# EAGLE board radiva5 (EAGLE 7.7.0)
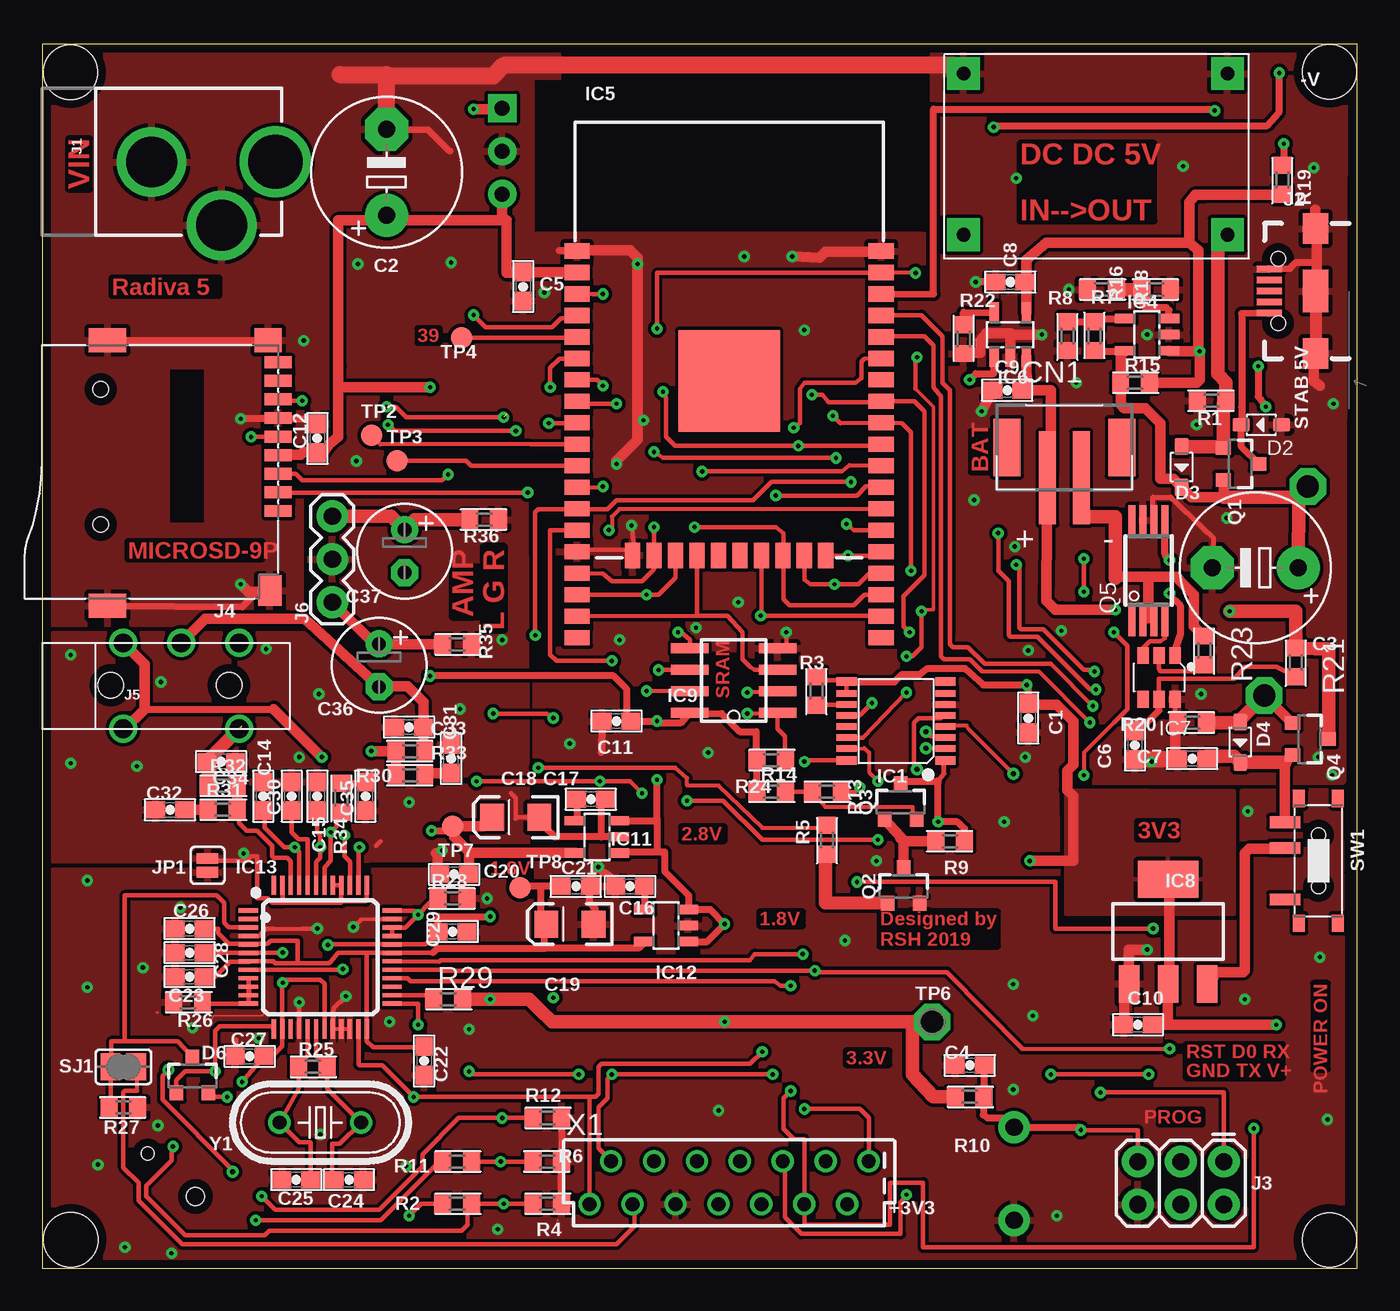
[diagram p2: board, top side]
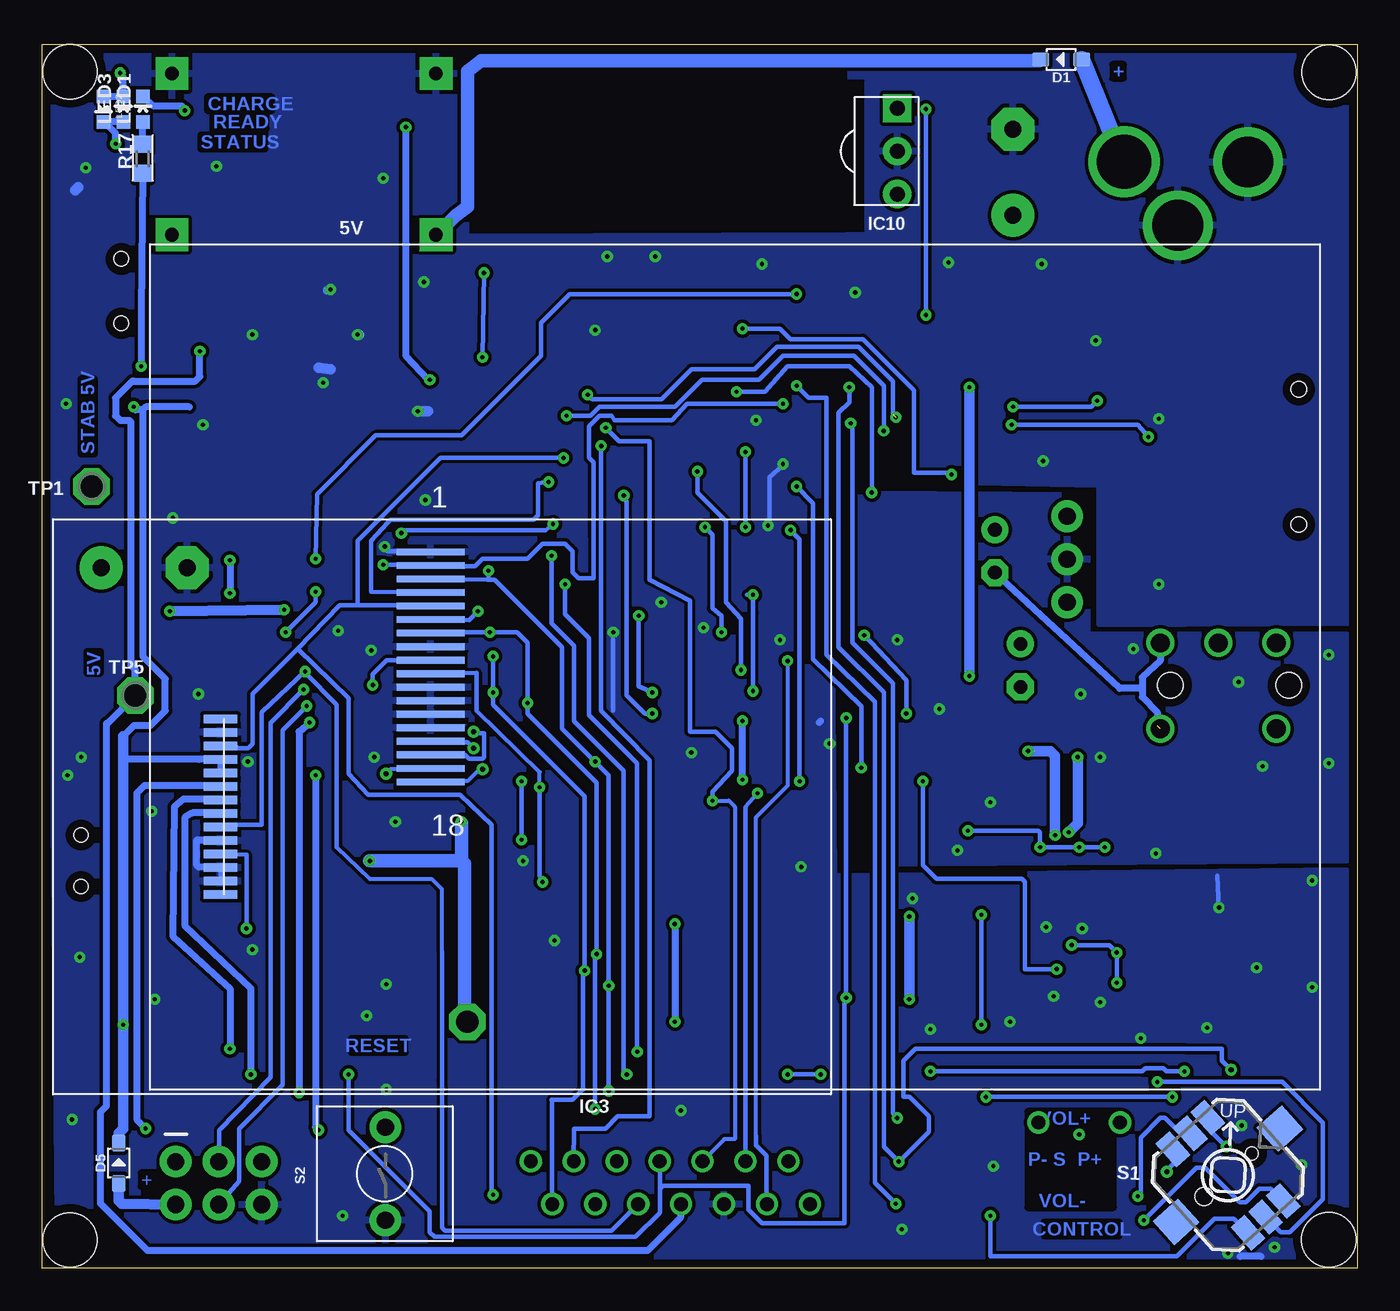
[diagram p3: board, bottom side, seen from below]

Size 77.78 x 72.38 mm. Coordinates in mm from the lower left corner, seen from the top.
Outline: 0,0 77.78,0 77.78,72.38 0,72.38 0,0
Copper layers (1*16): Top 0.035mm / dielectric 1.5mm / Bottom 0.035mm
Design rules "default *": minimum track width 5mil, minimum drill 0.3mm, track to track 8mil, track to pad 8mil, pad to pad 8mil, via to via 8mil, smd to smd 8mil, copper to edge 0.5mm, drill to drill 8mil, minimum pad ring 10mil, minimum via ring 8mil, stop-mask expansion 4mil, vias tented up to drill 0.8mm, thermal gap 10mil
Net classes: 0 default: clearance 0.205 mm; 1 power: width 0.406 mm
Holes 3.2 mm at 1.68,1.69 76.14,1.68 1.66,70.73 76.14,70.75

## Footprints (pad centres in the part's own frame; a part is rotated, then mirrored left to right if it is on the bottom)
0603-CAP = smd 1.1 x 1: 1 -0.85,0; 2 0.85,0
E5-8,5 = drill 1.016 pad 2.54: + -2.54,0 | drill 1.016 pad 2.54 octagon: - 2.54,0
EIA3216 = smd 1.4 x 1.6: A 1.4,0; C -1.4,0
E2,5-6 = drill 0.813 pad 1.6: + -1.27,0 | drill 0.813 pad 1.6 octagon: - 1.27,0
JST-PH-2-SMT = smd 1 x 5.5: 1 -1,-1.8; 2 1,-1.8 | smd 1.6 x 3.4: NC1 -3.4,0; NC2 3.4,0
SOD-323 = smd 1 x 0.8: + -1.2,0; - 1.2,0
SOT23-3 = smd 0.8 x 0.9: 1 -0.95,-1; 2 0.95,-1; 3 0,1.1
TSSOP16-0.65-5X4.4MM = smd 0.5 x 1.2: 1 -2.325,-2.925; 8 2.325,-2.925; 9 2.325,2.925; 16 -2.325,2.925 | smd 0.4 x 1.2: 2 -1.625,-2.925; 3 -0.975,-2.925; 4 -0.325,-2.925; 5 0.325,-2.925; 6 0.975,-2.925; 7 1.625,-2.925; 10 1.625,2.925; 11 0.975,2.925; 12 0.325,2.925; 13 -0.325,2.925; 14 -0.975,2.925; 15 -1.625,2.925
DC-DC_MP2307DN = drill 0.8 pad 1.93 square: VIN+ -7.747,-4.318; VIN- -7.747,5.207; VOUT+ 7.874,-4.318; VOUT- 7.874,5.207
TFT-DISPLAY-2.8 = smd 4 x 0.4: P$1 -18,6.8; P$2 -18,6; P$3 -18,5.2; P$4 -18,4.4; P$5 -18,3.6; P$6 -18,2.8; P$7 -18,2; P$8 -18,1.2; P$9 -18,0.4; P$10 -18,-0.4; P$11 -18,-1.2; P$12 -18,-2; P$13 -18,-2.8; P$14 -18,-3.6; P$15 -18,-4.4; P$16 -18,-5.2; P$17 -18,-6; P$18 -18,-6.8
SOT23-5 = smd 0.55 x 1.2: 1 -0.95,-1.3; 2 0,-1.3; 3 0.95,-1.3; 4 0.95,1.3; 5 -0.95,1.3
ESP-WROOM-WROOVER-32 = smd 0.9 x 1.5: 1 7.7,9; 2 6.43,9; 3 5.16,9; 4 3.89,9; 5 2.62,9; 6 1.35,9; 7 0.08,9; 8 -1.19,9; 9 -2.46,9; 10 -3.73,9; 11 -5,9; 12 -6.27,9; 13 -7.54,9; 14 -8.81,9; 25 -8.81,-9; 26 -7.54,-9; 27 -6.27,-9; 28 -5,-9; 29 -3.73,-9; 30 -2.46,-9; 31 -1.19,-9; 32 0.08,-9; 33 1.35,-9; 34 2.62,-9; 35 3.89,-9; 36 5.16,-9; 37 6.43,-9; 38 7.7,-9; 39 -10.08,9; 40 -11.35,9; 41 -12.62,9; 42 -13.89,9; 43 -15.16,9; 44 -15.16,-9; 45 -13.89,-9; 46 -12.62,-9; 47 -11.35,-9; 48 -10.08,-9 | smd 1.5 x 0.9: 15 -10.3,5.715; 16 -10.3,4.445; 17 -10.3,3.175; 18 -10.3,1.905; 19 -10.3,0.635; 20 -10.3,-0.635; 21 -10.3,-1.905; 22 -10.3,-3.175; 23 -10.3,-4.445; 24 -10.3,-5.715 | smd 6 x 6: GND 0,0
SOT-23-6 = smd 0.69 x 1: 1 -0.95,-1.3; 2 0,-1.3; 3 0.95,-1.3; 4 0.95,1.3; 5 0,1.3; 6 -0.95,1.3
SOT223 = smd 1.219 x 2.235: 1 -2.311,-3.099; 2 0,-3.099; 3 2.311,-3.099 | smd 3.6 x 2.2: 4 0,3.099
SO-08 = smd 0.6 x 2.2: 1 -1.905,-2.6; 2 -0.635,-2.6; 3 0.635,-2.6; 4 1.905,-2.6; 5 1.905,2.6; 6 0.635,2.6; 7 -0.635,2.6; 8 -1.905,2.6
IR = drill 0.9 pad 1.676 square: P$1 -2.54,0 | drill 0.9 pad 1.676: P$2 0,0; P$3 2.54,0
LQFP-48 = smd 0.254 x 1.143: 1 -2.75,-4.25; 2 -2.25,-4.25; 3 -1.75,-4.25; 4 -1.25,-4.25; 5 -0.75,-4.25; 6 -0.25,-4.25; 7 0.25,-4.25; 8 0.75,-4.25; 9 1.25,-4.25; 10 1.75,-4.25; 11 2.25,-4.25; 12 2.75,-4.25; 25 2.75,4.25; 26 2.25,4.25; 27 1.75,4.25; 28 1.25,4.25; 29 0.75,4.25; 30 0.25,4.25; 31 -0.25,4.25; 32 -0.75,4.25; 33 -1.25,4.25; 34 -1.75,4.25; 35 -2.25,4.25; 36 -2.75,4.25 | smd 1.143 x 0.254: 13 4.25,-2.75; 14 4.25,-2.25; 15 4.25,-1.75; 16 4.25,-1.25; 17 4.25,-0.75; 18 4.25,-0.25; 19 4.25,0.25; 20 4.25,0.75; 21 4.25,1.25; 22 4.25,1.75; 23 4.25,2.25; 24 4.25,2.75; 37 -4.25,2.75; 38 -4.25,2.25; 39 -4.25,1.75; 40 -4.25,1.25; 41 -4.25,0.75; 42 -4.25,0.25; 43 -4.25,-0.25; 44 -4.25,-0.75; 45 -4.25,-1.25; 46 -4.25,-1.75; 47 -4.25,-2.25; 48 -4.25,-2.75
POWER_JACK_PTH_LOCK = drill 2.997 pad 4.115: GND 0.025,6.557; GNDBREAK 3.762,10.7 | drill 3.2 pad 4.115: PWR 0,13.878
USB-B-MICRO-SMD = smd 1.45 x 0.4: D+ 2.725,0; D- 2.725,0.65; GND 2.725,-1.3; ID 2.725,-0.65; VBUS 2.725,1.3 | smd 1.5 x 1.8: SHIELD1 0,3.685; SHIELD2 0,-3.685 | smd 1.5 x 2.5: SHIELD3 0,0 | hole 0.85: 2.2,1.9; 2.2,-1.9
2X3 = drill 1.016 pad 1.88: 1 0,0; 2 0,2.54; 3 2.54,0; 4 2.54,2.54; 5 5.08,0; 6 5.08,2.54
MICRO-SD9+4P-SMD-16.1X14.5X1.85MM = smd 1.6 x 0.7: 1 0,2.25; 2 0,1.15; 3 0,0.05; 4 0,-1.05; 5 0,-2.15; 6 0,-3.25; 7 0,-4.35; 8 0,-5.45; 9 0,-6.55 | smd 1.6 x 1.4: G1 0.6,-7.85 | smd 2.2 x 1.4: G2 10.1,-7.85; G3 10.1,7.85 | smd 1.4 x 1.8: G4 0.5,6.95 | hole 0.9: 10.5,-4.95; 10.5,3.05
AUDIO-JACK = drill 1.1: P$1 0,0; P$2 0,-3.429; P$3 0,-6.858; P$4 5.08,-6.858; P$5 5.08,0 | hole 1.5: 2.5,-0.6; 2.5,-7.6
1X03 = drill 1.016 pad 1.88: 1 0,0; 2 2.54,0; 3 5.08,0
SJ_2S = smd 0.635 x 1.27: 1 -0.412,0; 2 0.412,0
JD-T1800 = smd 0.5 x 2: 1 5.2,-13.1; 2 4.4,-13.1; 3 3.6,-13.1; 4 2.8,-13.1; 5 2,-13.1; 6 1.2,-13.1; 7 0.4,-13.1; 8 -0.4,-13.1; 9 -1.2,-13.1; 10 -2,-13.1; 11 -2.8,-13.1; 12 -3.6,-13.1; 13 -4.4,-13.1; 14 -5.2,-13.1
LED-0603 = smd 0.8 x 0.8: A 0,-0.75; C 0,0.75
TSSOP-8 = smd 0.42 x 1.78: 1 -0.975,-2.975; 2 -0.325,-2.975; 3 0.325,-2.975; 4 0.975,-2.975; 5 0.975,2.975; 6 0.325,2.975; 7 -0.325,2.975; 8 -0.975,2.975
R0603 = smd 1 x 1.1: 1 -0.85,0; 2 0.85,0
JOYSTICK_MINI = smd 1.85 x 1.1: A -3.325,1.4; B 3.325,1.4; C -3.325,-1.4; CTR -3.325,0; D 3.325,-1.4; GND 3.325,0 | smd 1.9 x 2: NC 0,4.13; NC@0 0,-4.13 | hole 0.75: 0,1.9 | hole 1.05: 0,-1.9
TACTILE_SWITCH_PTH_8.0MM = drill 1.016 pad 1.88: 1 -2.851,-0.039; 2 2.651,-0.039
SJ = smd 1.168 x 1.6: 1 -0.762,0; 2 0.762,0
SW7-SMD-L6.7X2.7X3.2MM = smd 1.8 x 0.7: A 1.978,2.286; B 1.978,-2.286; COM 1.978,-0.762 | smd 0.7 x 1.016: SS1 -1.15,-3.683; SS2 1.15,-3.683; SS3 1.15,3.683; SS4 -1.15,3.683 | hole 0.813: 0,-1.524; 0,1.524
P1-13 = drill 1.321 pad 2.159 octagon: TP 0,0
B1,27 = smd 1.27 x 1.27: TP 0,0
FSIDE-14 = drill 0.813: 1 -8.255,-1.27; 2 -6.985,1.27; 3 -5.715,-1.27; 4 -4.445,1.27; 5 -3.175,-1.27; 6 -1.905,1.27; 7 -0.635,-1.27; 8 0.635,1.27; 9 1.905,-1.27; 10 3.175,1.27; 11 4.445,-1.27; 12 5.715,1.27; 13 6.985,-1.27; 14 8.255,1.27
HC49U = drill 0.813: 1 -2.413,0; 2 2.413,0

## Placement (x,y rotation side)
C1  106C  [0603-CAP]  58.32,32.54 90 top
C2  108C  [E5-8,5]  20.36,64.81 90 top
C3  687C  [E5-8,5]  71.74,41.43 180 top
C4  104C  [0603-CAP]  54.85,12 0 top
C5  106C  [0603-CAP]  28.45,58.05 270 top
C6  106C  [0603-CAP]  64.63,30.94 90 top
C7  106C  [0603-CAP]  68.01,30.14 0 top
C8  106C  [0603-CAP]  57.25,58.32 180 top
C9  106C  [0603-CAP]  57.07,51.92 0 top
C10  106C  [0603-CAP]  64.81,14.4 0 top
C11  106C  [0603-CAP]  33.96,32.36 180 top
C12  106C  [0603-CAP]  16.27,49.07 90 top
C14  104C  [0603-CAP]  13.07,27.91 90 top
C15  104C  [0603-CAP]  16.27,27.91 90 top
C16  104C  [0603-CAP]  34.76,22.58 180 top
C17  104C  [0603-CAP]  32.45,27.74 0 top
C18  106C  [EIA3216]  28,26.67 180 top
C19  106C  [EIA3216]  31.2,20.36 180 top
C20  104C  [0603-CAP]  24.36,23.29 180 top
C21  104C  [0603-CAP]  31.56,22.58 0 top
C22  104C  [0603-CAP]  22.58,12.27 270 top
C23  104C  [0603-CAP]  8.71,17.25 180 top
C24  18pF  [0603-CAP]  18.14,5.25 180 top
C25  18pF  [0603-CAP]  15.02,5.25 0 top
C26  104C  [0603-CAP]  8.71,20.09 180 top
C27  104C  [0603-CAP]  12.27,12.53 180 top
C28  104C  [0603-CAP]  8.71,18.67 180 top
C29  103C  [0603-CAP]  24.27,19.91 0 top
C30  105C  [0603-CAP]  14.76,27.91 270 top
C31  103C  [0603-CAP]  24.18,30.14 90 top
C32  103C  [0603-CAP]  7.56,27.11 180 top
C33  033C  [0603-CAP]  21.69,32 180 top
C34  033C  [0603-CAP]  10.58,29.96 0 top
C35  473C  [0603-CAP]  19.11,27.91 270 top
C36  227C  [E2,5-6]  19.91,35.65 270 top
C37  227C  [E2,5-6]  21.42,42.41 270 top
CN1  BAT  [JST-PH-2-SMT]  60.45,48.54 0 top
D1  S4  [SOD-323]  17.51,71.48 180 bottom
D2  S4  [SOD-323]  72.1,49.87 180 top
D3  S4  [SOD-323]  67.39,47.38 270 top
D4  S4  [SOD-323]  70.85,31.11 270 top
D5  S4  [SOD-323]  73.25,6.22 90 bottom
D6  BAV60  [SOT23-3]  8.89,11.38 0 top
IC1  TOUCH  [TSSOP16-0.65-5X4.4MM]  50.5,32.36 90 top
IC2  DC-DC 5V  [DC-DC_MP2307DN]  62.23,65.43 0 top
IC3  TFT-DISPLAY-2.8  [TFT-DISPLAY-2.8]  36.8,35.56 0 bottom
IC4  SY6280  [SOT23-5]  65.34,55.21 90 top
IC5  ESP  [ESP-WROOM-WROOVER-32]  40.63,52.45 90 top
IC6  LT4  [SOT23-5]  57.25,55.21 0 top
IC7  DW01  [SOT-23-6]  66.05,34.94 180 top
IC8  LM1117-3.3  [SOT223]  66.59,19.91 0 top
IC9  SRAM  [SO-08]  40.89,34.76 90 top
IC10  VS1838  [IR]  27.2,66.05 270 bottom
IC11  2.8V  [SOT23-5]  32.8,25.51 90 top
IC12  1.8V  [SOT23-5]  36.89,20.27 90 top
IC13  VS1053B  [LQFP-48]  16.45,18.4 270 top
J1  VIN  [POWER_JACK_PTH_LOCK]  -0.09,65.43 270 top
J2  [USB-B-MICRO-SMD]  75.3,57.78 180 top
J3  PROG  [2X3]  69.88,6.31 180 top
J4  MICROSD-9P  [MICRO-SD9+4P-SMD-16.1X14.5X1.85MM]  13.96,47.03 180 top
J5  AUDIO-JACK  [AUDIO-JACK]  11.65,36.98 270 top
J6  AMP  [1X03]  17.16,39.38 90 top
JP1  A-G  [SJ_2S]  9.78,23.83 90 top
LCD1  TFT-DISPLAY-1.8  [JD-T1800]  54.14,27.29 270 bottom
LED1  STATUS  [LED-0603]  71.83,68.54 0 bottom
LED2  READY  [LED-0603]  74.14,68.54 180 bottom
LED3  CHARGE  [LED-0603]  72.99,68.54 0 bottom
Q1  S1  [SOT23-3]  70.85,47.56 270 top
Q2  Q2  [SOT23-3]  50.94,22.58 0 top
Q3  Q3  [SOT23-3]  50.76,27.56 0 top
Q4  S1  [SOT23-3]  74.94,31.29 270 top
Q5  8205A  [TSSOP-8]  65.43,41.25 0 top
R1  104R  [R0603]  69.16,51.3 180 top
R2  103R  [R0603]  24.54,3.82 0 top
R3  103R  [R0603]  45.78,34.14 270 top
R4  103R  [R0603]  29.87,3.82 0 top
R5  102R  [R0603]  46.41,25.34 270 top
R6  103R  [R0603]  29.87,6.31 180 top
R7  104R  [R0603]  62.23,55.12 90 top
R8  104R  [R0603]  60.63,55.12 270 top
R9  103R  [R0603]  53.7,25.25 180 top
R10  104R  [R0603]  54.85,10.13 0 top
R11  103R  [R0603]  24.54,6.31 0 top
R12  103R  [R0603]  29.87,8.89 0 top
R13  100R  [R0603]  46.41,28.18 0 top
R14  000  [R0603]  43.12,28.18 0 top
R15  000  [R0603]  64.63,52.36 0 top
R16  682R  [R0603]  65.87,57.87 180 top
R17  102R  [R0603]  71.83,65.61 90 bottom
R18  682R  [R0603]  62.67,57.87 0 top
R19  102R  [R0603]  73.34,64.36 270 top
R20  103R  [R0603]  68.01,32.27 180 top
R21  101R  [R0603]  74.14,35.83 270 top
R22  112R  [R0603]  54.5,54.94 90 top
R23  102R  [R0603]  68.72,36.54 270 top
R24  103R  [R0603]  43.12,30.05 0 top
R25  105R  [R0603]  16,11.91 0 top
R26  104R  [R0603]  8.62,15.74 0 top
R27  103R  [R0603]  4.8,9.51 180 top
R28  104R  [R0603]  24.27,21.87 180 top
R29  104R  [R0603]  24,15.91 0 top
R30  200R  [R0603]  21.78,29.16 180 top
R31  200R  [R0603]  10.67,27.11 0 top
R32  471R  [R0603]  10.67,28.54 0 top
R33  471R  [R0603]  21.78,30.58 180 top
R34  100R  [R0603]  17.69,27.83 270 top
R35  473R  [R0603]  24.54,36.89 0 top
R36  473R  [R0603]  26.14,44.27 180 top
S1  CONTROL  [JOYSTICK_MINI]  7.65,5.51 312 bottom
S2  RESET  [TACTILE_SWITCH_PTH_8.0MM]  57.52,5.69 90 bottom
SJ1  XRST_ON  [SJ]  4.8,11.91 180 top
SW1  POWER ON  [SW7-SMD-L6.7X2.7X3.2MM]  75.48,24.09 180 top
TP1  STAB 5V  [P1-13]  74.85,46.23 270 bottom
TP2  25  [B1,27]  19.47,49.25 0 top
TP3  26  [B1,27]  20.98,47.74 0 top
TP4  39  [B1,27]  24.8,55.03 180 top
TP5  5V  [P1-13]  72.28,33.87 0 bottom
TP6  3.3V  [P1-13]  52.63,14.58 0 top
TP7  2.8V  [B1,27]  24.27,26.14 0 top
TP8  1.8V  [B1,27]  28.27,22.49 0 top
X1  [FSIDE-14]  40.63,5.07 0 top
Y1  12.288MHz  [HC49U]  16.45,8.62 0 top

## Tracks (layer width: path | path; a pad name or v marks a point on that pad's centre or on a via)
0  (via drill 0.25 pad 0.61)
  Top 0.254: v47.56,44.01 48.01,43.65 IC5.25 | v62.32,34.23 61.96,34.23 58.85,37.34 57.25,37.34 57.16,37.43 57.16,40.63 56.54,41.25 56.54,43.38 v56.54,43.47
  Bottom 0.254: J3.3 67.3,8.18 64.28,11.29 64.28,32.27 v62.32,34.23 | v56.54,43.47 56.36,43.65 48.01,43.65 v47.56,44.01
5V  (via drill 0.25 pad 0.61)
  Top 0.406: C8.1 arc-90 58.23,58.23 IC6.4 | 73.34,63.48 R19.2
  Top 0.61: 69.08,32.54 R20.1 | Q4.1 TP5.TP | IC6.4 58.2,59.62 59.38,60.63 67.83,60.63 | v68.45,54.23 66.67,54.23 IC4.1 | R15.2 68.28,52.36 68.45,52.54 v68.45,54.23 | 67.83,60.63 68.36,60.19 68.36,60.01 68.36,55.3 68.36,54.32 v68.45,54.23 | 73.34,63.48 68.72,63.48 68.19,63.48 67.83,63.03 67.83,60.63
  Top 0.813: R20.1 70.81,32.27 D4.+ 70.85,32.45 TP5.TP
  Bottom 0.406: 73.17,32.98 TP5.TP | TP5.TP 73.9,32.24 Q4.1 73.97,32.22 73.97,9.78 73.97,9.6 74.32,9.25 74.32,8.98 74.32,7.64 74.32,3.82 72.36,1.87 71.56,1.07 42.05,1.07 41.96,1.07 40.01,3.02 40.01,3.79 X1.7 | TP5.TP 72.28,35.38 72.54,35.65 72.54,50.05 72.63,50.14 73.17,50.14 73.43,50.41 73.43,51.47 72.45,52.45 72.36,52.45 68.72,52.45 68.45,52.72 v68.45,54.23
5V_ON_OFF
  Top 0.254: 73.52,24.8 SW1.COM
  Top 0.61: 73.52,24.8 73.43,24.8 71.39,24.8 71.12,24.54 71.12,17.6 71.03,17.51 69.34,17.51 69.25,17.42 69.25,17.17 IC8.3
25
  Top 0.24: 28.89,48.72 20,48.72 TP2.TP
  Top 0.254: 28.89,48.72 IC5.10
26
  Top 0.254: IC5.11 25.36,47.45 25.07,47.74 TP3.TP
33  (via drill 0.25 pad 0.61)
  Top 0.254: R12.1 v27.2,8.89 24.62,8.89 22.49,6.76 22.49,6.04 19.91,3.47 13.87,3.47 13.78,3.47 v12.98,4.27 | IC5.9 31.65,49.96 v29.96,49.96
  Bottom 0.254: v29.96,49.96 29.87,49.61 29.87,48.9 29.87,36.98 27.47,34.58 27.47,9.16 v27.2,8.89 | S1.CTR 10.47,7.98 11.38,8.89 11.65,8.89 12.8,7.73 12.8,4.45 v12.98,4.27
34  (via drill 0.25 pad 0.61, 0.3)
  Top 0.254: R11.2 v27.11,6.31 R6.2 | IC5.6 31.65,53.78 30.58,53.78 30.05,53.25 v30.05,52.09 | v11.27,5.71 11.27,5.8 7.11,9.96 7.11,11.4 v7.46,11.75
  Bottom 0.127: 10.79,6.83 S1.C | 27.94,7.3 28,7.2
  Bottom 0.254: 10.76,6.84 10.85,6.93 S1.C 10.49,6.63 10.49,6.58 11.27,5.8 v11.27,5.71 | v30.05,52.09 30.05,51.21 30.67,50.58 30.67,36.72 28,34.05 28,7.2 v27.11,6.31 25.34,8.09 25.34,8.98 26.49,10.13 26.85,10.13 26.85,12.27 26.14,12.98 10.13,12.98 8,12.98 8,12.29 v7.46,11.75
35  (via drill 0.25 pad 0.61)
  Top 0.254: IC5.7 31.65,52.54 32.8,52.54 v33.16,52.18 | R4.1 v27.29,3.82 R2.2 25.16,3.82 25.16,2.58 24.8,2.22 13.42,2.22 13.16,1.96 11.2,1.96 8.45,1.96 8.18,2.22 6.13,4.27 6.13,4.89 7.64,6.4 7.64,7.11 v7.73,7.2
  Bottom 0.254: S1.A 8.8,8.8 8.8,8.62 8.8,8.27 v7.73,7.2 | 27.29,3.91 v27.29,3.82 28.54,5.07 28.54,33.52 31.38,36.27 31.38,51.47 32.45,51.47 v33.16,52.18
39
  Top 0.254: TP4.TP 31.65,55.03 IC5.5
+3V3  (via drill 0.25 pad 0.61)
  Top 0.127: 36.54,32.27 36.54,32.36 v36.36,32.36
  Top 0.24: 50.94,28.8 Q3.3 | 53.34,29.96 IC1.1
  Top 0.254: 47.56,34.76 IC1.9 47.56,34.76 | 47.56,34.76 IC1.9 47.56,33.96 IC1.10 | 47.56,34.76 45.87,34.76 45.87,34.85 R3.1 | IC1.1 53.43,30.05 | 42.23,28.09 42.23,28.18 42.23,28.27 R14.1 | 58.23,33.43 C1.2 57.96,33.25 | 67.3,22.85 66.67,22.85 66.67,22.94 IC8.4 | 66.67,16.89 IC8.2 | J4.4 14.05,48.09 | C10.2 66.59,14.4 | 16.54,48.09 C12.1 | v11.82,11.02 C27.1 | C27.1 13.34,12.71 | IC11.1 34.05,24.71 34.14,24.62 34.05,24.62 | 23.38,19.65 C29.1 22.66,19.15 IC13.32 17.56,19.15 17.47,19.15 16.93,19.15 v16.89,19.11 | C28.1 9.87,18.67 IC13.6 14.03,18.65 14.21,18.65 v14.22,18.67 | C27.1 13.21,12.62 13.69,12.62 14.2,13.13 IC13.14 14.2,16.86 v14.22,16.89 14.4,17.07 16.45,17.07 16.7,16.82 IC13.19 | 23.42,20.75 23.47,20.8
  Top 0.305: 52.98,28.8 53.34,29.25 53.34,29.96
  Top 0.406: 34.05,24.62 34.14,24.62 | IC1.9 50.41,34.67 50.85,35.12 51.92,35.12 52.36,35.47 54.59,35.47 55.65,34.49 v58.23,34.49 58.32,34.4 C1.2 | IC11.1 34.14,24.62 | v22.94,35.03 33.78,35.03 34.58,34.23 34.58,32.36 C11.1 v36.36,32.36 | v71.92,53.34 71.92,51.56 v72.36,50.94 | 36.36,32.27 36.54,32.27 37.78,32.27 IC9.8 40.18,32.8 41.25,31.74 42.23,31.74 42.23,30.05 R24.1 42.23,28.18 R14.1 | R9.1 54.55,26 54.41,26.14 54.14,26.4 v52.98,26.4 52.98,28.71 | 52.98,28.71 52.98,28.8 | 50.94,28.8 52.9,28.8 52.98,28.71 | C29.1 23.42,20.75 | 23.47,20.8 v26.49,20.8 | 34.14,24.62 36.36,24.62 | v36.36,28.89 36.36,26.58 36.24,26.46 IC11.3 36.33,26.46 36.36,26.49 36.36,24.62 | IC12.3 39.5,21.22 v40.36,20.36 39.32,19.32 IC12.1 | 38.23,21.25 IC12.3 | 36.36,24.62 36.8,24.62 36.8,23.56 36.8,23.47 38.23,22.05 38.23,21.25 | 38.23,21.25 IC12.3
  Top 0.61: 66.67,16.89 66.67,22.85 | 14.05,48.09 15.29,48.09 15.47,48.27 C12.1 | C10.2 66.59,14.4 | 66.59,14.4 v72.99,14.4 | 66.59,14.4 IC8.2 | 16.54,48.09 16.98,48.72 17.51,49.16 17.51,52.09 | 17.51,52.09 17.51,53.34 17.51,61.96 20.36,61.96 | 27.29,61.96 27.47,61.96 27.47,58.85 28.4,58.85 C5.1 31.61,58.9 IC5.2 | 27.29,61.96 20.36,61.96 | C2.+ 20.36,61.96 | C1.2 59.12,33.34 60.01,33.34 60.98,32.36 60.98,29.87 60.98,29.78 60.63,29.43 60.63,28.27 60.98,27.91 60.98,24.09 v58.41,24.09 | v22.94,52.09 17.51,52.09 | IC10.P$3 27.2,62.05 27.29,61.96
  Top 0.813: R29.2 v26.49,15.91 28.8,15.91 29.43,15.29 30.14,14.58 v40.36,14.58 51.47,14.58 | R10.1 52.72,10.13 51.47,11.47 51.47,14.58 | 51.47,14.58 TP6.TP 52.72,14.58
  Bottom 0.127: v52.98,26.4 53.02,26.35 52.98,26.31
  Bottom 0.24: 5.07,2.58 5.07,2.76 S1.GND
  Bottom 0.254: v58.23,34.49 58.23,35.12 57.43,35.92 57.38,35.96 IC3.P$9 | 67.21,29.46 LCD1.10 67.47,29.43 | 67.21,29.96 LCD1.11 | v16.89,19.11 14.67,19.11 v14.22,18.67 v14.22,16.89 | S1.GND 4.51,2.13 4,2.13 2.22,3.91 2.04,4.09 2.04,8.62 4.45,11.02 v11.82,11.02
  Bottom 0.305: v26.49,15.91 26.49,16.09
  Bottom 0.406: v40.36,20.36 v40.36,14.58 | v71.92,53.34 71.92,55.38 71.92,56.54 71.83,64.72 R17.1 | 67.21,29.96 67.21,29.46 67.21,29.39 LCD1.10 | 71.83,50.76 71.83,36.18 70.59,34.94 70.5,34.85 70.5,32.98 70.94,32.54 71.39,32.09 72.36,32.09 72.99,31.47 | 69.08,50.94 71.65,50.94 71.83,50.76 | 71.83,50.76 72.28,50.76 v72.36,50.94 | v36.36,28.89 36.36,32.27 v36.36,32.36 | LCD1.11 68.5,30.09 72.99,30.09 72.99,30.05
  Bottom 0.61: v22.94,52.09 v22.94,35.03 | 26.49,16.09 v26.49,20.8 | 72.99,31.47 72.99,30.05 72.99,28.54 v72.99,14.4 72.99,8.27 73.25,8 D5.-
  Bottom 0.813: v58.41,24.09 52.98,24.09 | 52.98,24.09 52.98,26.31 | 52.98,24.09 52.81,23.91 52.81,14.58 TP6.TP
  pour Top: 60.58,20.93 70.48,20.95 70.48,28.21 60.58,28.27
_LED  (via drill 0.25 pad 0.61)
  Top 0.406: IC5.36 52.72,57.61 52.72,68.54 69.25,68.54 v69.34,68.45
  Bottom 0.406: v69.34,68.45 69.52,68.72 71.21,68.72 LED1.C
_VIN+
  Bottom 0.61: 18.8,71.39 D1.-
  Bottom 0.813: IC2.VIN+ 53.34,62.23 52.63,62.76 52.63,63.48 52.63,70.76 51.83,71.39 18.8,71.39
A/D  (via drill 0.25 pad 0.61)
  Top 0.254: 31.83,45.07 IC5.13 | v30.23,32.54 29.87,32.8 26.94,32.8 v26.67,32.8 | v59.65,11.47 v65.43,11.47 | IC5.13 31.61,44.9 29.87,44.9 29.34,44.9 29.16,44.72 v29.16,37.43 | v47.83,46.49 43.12,46.49 42.05,45.43 33.96,45.43 33.43,44.9 31.64,44.9 IC5.13
  Bottom 0.203: 67.3,26.85 LCD1.7 | 30.32,15.91 v30.23,16
  Bottom 0.254: IC3.P$4 56.1,39.92 54.76,39.92 53.43,39.92 58.32,40.01 58.32,43.03 57.34,44.09 57.16,44.27 48.72,44.27 48.45,44.54 48.45,46.41 v47.83,46.49 | v30.23,32.54 v30.23,16 | 36.01,3.47 36.01,4.89 | 36.01,3.47 35.2,2.67 30.32,2.67 30.32,15.91 | v59.65,11.47 59.65,8.18 57.96,6.49 54.85,3.38 54.85,2.13 54.59,1.87 42.67,1.87 41.25,3.29 41.25,4.71 | 41.25,4.71 41.25,6.33 X1.8 | 36.01,3.47 36.01,4.89 | 36.01,4.89 41.07,4.89 41.25,4.71 | v26.67,32.8 26.67,34.76 v29.16,37.43
  Bottom 0.406: 67.21,26.94 LCD1.7 67.21,26.94 | v65.43,11.47 65.43,16.54 69.34,20.27 69.34,26.67 68.9,26.94 67.21,26.94
AGND  (via drill 0.25 pad 0.25, 0.25 pad 0.61)
  Top 0.254: C17.2 33.07,27.83 | 33.07,25.51 IC11.2 | 17.69,21.6 17.16,21.6 14.22,21.6 | JP1.2 9.87,24.09 12.09,24.09 12.36,24.36 12.71,24.36 12.71,23.47 12.71,21.87 13.34,21.87 13.6,21.6 14.22,21.6 | 23.38,23.74 C20.2 | 19.74,24.98 20,25.25 | 17.69,21.6 17.69,22.67 IC13.40 IC13.41 | 14.22,21.6 14.22,22.62 IC13.47 | IC13.37 19.2,21.77 19.11,21.69 17.78,21.69 17.69,21.6 | C18.C 28.09,26.67 28,26.58 28,27.83 27.74,28.09
  Top 0.406: IC11.2 33.07,25.51 | 33.07,25.51 30.32,25.51 29.78,26.05 C18.C | 33.07,25.51 33.07,27.51 C17.2
  Top 0.61: 23.38,23.74 23.38,24.45 23.29,24.54
  other vias: 1.69,29.87 1.69,36.27 5.6,29.69 15.2,30.23 23.65,24.71 27.2,37.16 11.91,24.54 16.36,33.96 13.25,36.63 7.02,34.67 21.69,27.56 24.71,33.07
  pour Top: 0.64,37.47 0.64,24.13 28.66,24.23 28.57,45.72 15.88,45.72 15.88,37.47
  pour Bottom: 0.64,37.45 0.64,24.13 29.62,23.93 29.31,45.8 15.98,45.72 15.98,37.45
AMP_L
  Top 0.61: R35.1 19.65,36.89 | 19.65,36.89 J6.1 | 19.65,36.89 19.89,36.89 C36.+
AMP_R
  Top 0.813: R36.2 22.02,44.27 C37.+ 20.64,44.46 J6.3
AVDD  (via drill 0.25, 0.25 pad 0.61)
  Top 0.254: 25.25,23.47 C20.1 | IC13.43 16.2,24.02 16.27,24.09 16.45,24.27 v16.45,24.89 16.45,25.6 16.27,25.78 C15.1 | IC13.38 18.7,24.83 v18.76,24.89 | IC13.45 15.2,24.63 v14.94,24.89 14.31,24.89 13.16,26.05 13.16,26.8
  Top 0.406: v23.02,25.87 23.91,25.87 TP7.TP 24.62,26.14
  Top 0.61: IC11.5 25.45,24.56 | 25.45,24.56 25.25,24.36 25.25,23.33 C20.1 | 24.62,26.14 26.07,26.14 C18.A | 13.16,26.8 13.16,26.98 C14.1 | 25.45,24.56 25.31,24.56 24.36,25.51 24.36,26.05 TP7.TP
  Bottom 0.254: v14.94,24.89 v16.45,24.89 v18.76,24.89 18.76,25.78 18.85,25.87 v23.02,25.87
BAT+5V
  Top 0.61: C7.2 68.86,30.28 | SW1.B 73.5,29.9 Q4.2
  Top 0.813: 73.5,29.9 73.48,29.91 D4.- 70.49,30.28 68.86,30.28
BL  (via drill 0.25 pad 0.61)
  Top 0.24: 37.43,29.6 38.14,28.98 38.14,28.54 40.01,28.54 42.58,26.05 46.23,26.05 R5.1
  Top 0.254: IC5.12 33.16,46.14 v33.16,46.23 | 37.43,29.6 v29.34,29.6
  Bottom 0.254: v29.34,29.6 29.34,33.25 32.18,36.01 32.18,45.25 v33.16,46.23
CHARGE  (via drill 0.25 pad 0.61)
  Top 0.406: v56.27,67.47 56.27,67.56 72.45,67.56 73.17,68.36 v73.17,70.67 | v54.85,52.54 55.21,52.9 56.27,52.9 IC6.1
  Bottom 0.406: v56.27,67.47 56.27,53.96 54.94,52.54 v54.85,52.54 | LED2.A LED3.C 72.99,70.41 v73.17,70.67
CS_SD  (via drill 0.25 pad 0.61)
  Top 0.254: IC5.29 49.52,48.63 44.81,48.63 | 44.81,48.63 37.43,48.63 36.89,49.16 36.89,51.47 v36.72,51.83 | J4.2 28.54,45.87 | v44.72,48.63 44.81,48.63 | 28.54,45.87 v28.71,45.87 | v28.71,45.87 28.54,45.87 | 28.71,45.7 v28.71,45.87
  Bottom 0.254: v44.72,48.63 44.72,32.98 41.87,30.05 41.87,8.98 43.74,8.98 44.45,8.27 46.32,8.27 X1.12 | v36.72,51.83 35.03,51.83 33.69,53.34 30.05,53.34 28.71,52.09 v28.71,45.87
CS_TOUCH  (via drill 0.25 pad 0.61)
  Top 0.24: IC1.15 48.63,30.76 48.9,30.49 48.9,29.34 v49.43,28.8
  Top 0.254: v49.43,25.34 42.58,25.34 40.27,27.65 38.32,27.65 v38.14,27.65 | v44.45,49.7 44.81,49.96 44.81,52.01 45.07,52.36 48.09,52.36 48.45,52.63 48.45,53.61 48.63,53.78 IC5.33
  Bottom 0.24: v38.14,27.65 37.16,27.65 36.8,27.29 36.8,7.64 37.43,7.64 X1.6
  Bottom 0.254: v38.14,27.65 38.14,28.18 36.98,29.43 36.98,30.76 37.96,31.74 39.47,31.74 39.47,39.47 41.87,40.72 41.87,48.9 43.65,48.9 v44.45,49.7 | v49.43,28.8 v49.43,25.34
CVDD
  Top 0.254: 20.71,18.67 IC13.31 20.71,18.67 | 20.71,18.67 23.11,18.67 | 19.2,18.67 20.71,18.67 | C19.A 29.52,20.71 | 12.27,18.14 IC13.7 | 9.69,17.16 C23.1 10.22,17.25 11.11,18.14 12.18,18.14 IC13.7 | C26.1 10.4,20.09 10.4,19.82 11.02,19.2 12.15,19.2 IC13.5 12.25,19.2 13.34,19.2 13.51,19.38 13.78,19.38 15.11,19.38 15.11,18.14 15.2,18.05 | 19.2,18.67 19.2,18.66 IC13.24 19.2,13.43 19.56,13.07 22.53,13.07 C22.1 | 19.2,18.67 17.51,18.67 17.07,18.14 16.98,18.05 15.2,18.05 | IC13.7 13.67,18.15 13.78,18.05 15.2,18.05
  Top 0.406: C19.A 29.69,20.25 29.69,19.02 29.78,18.94 | C21.1 29.6,22.58 | 29.6,22.58 28.36,22.58 TP8.TP | 29.52,20.71 29.52,22.49 29.6,22.58 | 23.11,18.67 23.38,18.94 29.78,18.94 | IC12.5 35.59,19.24 35.29,18.94 29.78,18.94
DREQ  (via drill 0.25 pad 0.61)
  Top 0.24: 34.76,28.8 v35.47,28.09 | 49.43,44.9 34.14,44.9 33.69,44.45 33.69,43.83 v33.52,43.65
  Top 0.254: v25.69,28.8 v32.98,28.8 34.76,28.8 | IC5.26 49.52,44.98 49.43,44.9 | IC13.8 17.74,17.65 v17.78,17.69
  Bottom 0.24: 36.18,27.2 36.18,27.29 v35.47,28.09
  Bottom 0.254: v17.78,17.69 19.65,17.69 19.65,22.85 19.82,23.02 24.89,23.02 25.69,23.82 v25.69,28.8 | X1.4 36.18,27.2 | v32.98,28.8 32.98,43.12 v33.52,43.65
FUSE_EN
  Top 0.254: R7.2 62.23,56.01
  Top 0.406: R7.2 62.14,56.1 | R7.2 62.42,56.16 IC4.4 | R8.1 R7.2
FUSE_SET
  Top 0.406: 64.99,57.87 R16.2 65.08,57.82 65.08,56.98 65.25,56.81 66.5,56.81 66.64,56.66 IC4.3
  Top 0.61: 64.99,57.87 R16.2
  Top 0.813: 64.99,57.87 R18.2
GBUF  (via drill 0.25 pad 0.61)
  Top 0.254: IC13.42 16.7,23.72 17.07,24.09 v17.07,25.78 17.16,25.87 17.42,26.14 17.42,26.71 R34.2
  Top 0.406: 6.04,33.07 13.69,33.07
  Top 0.61: J5.P$4 4.88,31.9 6.04,33.07 6.04,35.73 J5.P$3 | 13.69,33.07 v16.54,30.23
  Bottom 0.61: v16.54,30.23 16.54,26.31 v17.07,25.78
GND  (via drill 0.25 pad 0.61)
  Top 0.09: 13.34,15.2 12.98,14.94 10.13,14.94 10.05,14.76 | 5.87,9.51 R27.1
  Top 0.127: 6.84,15.11 6.76,15.11 | 30.48,2.86 30.48,2.82 30.48,2.86
  Top 0.24: IC13.35 18.85,20.62 v18.4,20.18 | IC13.20 IC13.21 IC13.22 | 13.69,20.09 15.38,20.09
  Top 0.254: 31.56,60.19 31.65,60.19 IC5.1 | R27.1 5.51,9.6 | R4.2 30.76,3.82 | 12.27,19.65 IC13.4 12.8,19.65 13.25,20.09 13.69,20.09 | IC1.6 | R20.2 67.3,32.27 | 67.12,32.36 67.12,32.54 67.21,32.54 R20.2 | v44.01,37.6 44.01,37.52 44.01,36.72 IC9.4 | 32.54,22.76 C21.2 32.54,22.49 | 33.78,22.76 C16.2 33.96,22.76 | 32.72,20.54 C19.C 32.54,20.54 | 64.28,16.98 IC8.1 | 64.01,16.71 64.28,16.71 IC8.1 | 64.01,14.49 C10.1 64.01,14.22 | IC5.39 31.74,42.49 34.49,42.49 34.76,42.23 IC5.15 35.03,42.49 v34.85,43.92 | 33.96,47.74 v33.96,47.56 | 13.51,39.92 J4.G4 13.25,39.92 | 13.96,50.23 J4.6 13.78,50.23 | 13.51,54.94 J4.G1 13.51,54.67 | 14.49,4.98 C25.1 14.13,5.25 | 19.02,4.98 C24.1 | 64.01,16.98 IC8.1 | 19.02,5.51 C24.1 | C27.2 11.47,13.51 | IC13.16 v15.2,15.73 | 19.02,5.33 C24.1 | IC7.6 67.03,32.36 R20.2 | IC13.20 17.2,15.24 17.25,15.29 17.25,15.38 v17.96,16.09 | v16.27,20.09 15.38,20.09 | 15.96,50.23 16.27,50.23 C12.2 15.96,50.23
  Top 0.305: Q5.6 65.7,44.54 65.7,45.61 66.76,45.61 69.25,43.2 C3.-
  Top 0.406: 32.72,20.54 32.72,21.25 32.36,21.6 32.36,22.58 C21.2 32.45,22.58 32.45,23.2 v32.89,23.74 33.16,23.38 33.34,23.38 33.78,23.02 33.78,22.76 | C22.2 22.76,11.38 | R4.2 R6.1 R12.2 | 30.58,60.19 31.56,60.19 IC5.1 | J4.G2 J4.G1 | 13.96,50.23 15.96,50.23 16.04,50.23 C12.2 | 13.78,50.23 11.82,50.23 v11.73,50.23 | J4.G3 11.82,39.12 12.71,40.01 13.42,40.01 J4.G4 | 75.39,59.65 75.21,59.47 74.14,59.47 73.79,59.12 J2.GND 72.54,59.12 | 24.09,66.05 22.85,67.3 C2.- | C8.2 v55.21,58.32 | C11.2 33.07,30.49
  Top 0.61: J4.G4 12.18,40.01 v11.73,40.45 | 32.72,20.36 C19.C | 64.01,16.71 64.01,14.49 C10.1 | 67.12,32 R20.2 | C7.1 67.03,30.14 67.03,32.36 | 64.28,16.98 64.28,18.85 v65.34,18.85 | IC5.38 49.61,60.1 46.32,60.1 45.96,59.74 v44.36,59.83 | 31.65,60.19 34.76,60.19 35.2,59.74 v35.2,59.38 35.2,48.98 33.96,47.74 | 75.56,52.18 75.21,52.45 75.21,54.05 J2.SHIELD1 | J2.SHIELD3 75.3,54.67 75.39,54.59 75.39,59.65 75.39,61.34 J2.SHIELD2 75.3,62.59 | 57.25,55.21 IC6.2 57.25,55.21 | 57.25,55.21 57.25,55.3 55.83,55.3 55.47,54.85 55.47,54.14 R22.1 | C9.1 56.19,51.92 v55.56,50.67 | 57.25,55.21 v59.12,55.21
  Top 1.016: 17.6,70.59 20.36,70.59 20.36,70.5 | C2.- 20.36,70.5 | IC2.VIN- 53.96,71.12 27.29,71.12 26.67,70.5 20.36,70.5 | C6.1 C7.1
  Bottom 0.254: IC3.P$11 54.85,34.4 | IC3.P$12 54.85,33.52 IC3.P$12 | IC3.P$13 54.85,32.8 | 54.85,36.72 55.03,36.72 IC3.P$8 | v33.96,47.56 33.96,47.47 34.76,46.76 34.76,43.74 v34.85,43.92 | 44.01,32.98 44.01,37.52 v44.01,37.6 | LCD1.3 67.21,23.47 67.21,23.02 LCD1.2 67.03,23.02 | 66.59,31.74 LCD1.13 | 66.76,25.25 67.03,25.25 LCD1.5 | 55.03,33.52 IC3.P$12 | 54.85,42.41 IC3.P$1 54.85,42.41 | 54.85,42.41 57.34,42.41 57.52,42.58 | 8.27,23.2 v8.18,21.34
  Bottom 0.406: 31.83,32.27 31.74,32.36 | v60.72,57.87 60.98,57.87 60.98,57.78 | v55.21,58.32 55.21,58.41 | LCD1.3 68.54,23.74 68.63,23.82 68.63,25.34 67.21,25.34 LCD1.5 | 5.69,0.71 6.93,0.71
  Bottom 0.61: IC2.VOUT- 70.14,70.59 | 75.65,63.92 75.83,63.74 | v55.56,50.67 54.94,50.67 | v59.12,55.21 59.03,55.21 | 61.43,53.25 60.72,53.16
  other vias: 60.01,3.11 41.52,59.83 2.67,22.94 16.45,7.91 21.51,6.05 58.59,14.94 76.01,8.8 40.01,9.33 2.67,16.62 4.89,1.24 3.29,6.13 57.43,10.58 57.43,16.8 47.47,19.38 25.25,14.14 15.47,54.85 31.2,31.03 75.21,65.07 61.16,52.36 39.38,30.49 18.67,59.39 24.18,59.47 29.69,57.7 67.48,65.16 75.56,18.4 26.94,2.31 35.56,50.14 58.14,30.23 58.32,36.54 57.52,42.67 68.28,49.87 75.48,30.23 49.34,24.09 41.16,39.38 38.67,37.87 34.14,37.16 56.9,26.4 71.12,15.91 55.12,45.43 26.31,21.87 8.89,14.22 5.96,17.78 20.54,14.58 65.61,29.96 68.54,33.96 76.28,29.16 71.3,27.03 70.05,44.36 57.61,64.45 45.07,55.47 12.8,13.6 6.85,8.45 7.65,0.89 76.37,51.12 65.34,55.21 60.27,37.69 18.58,47.74
  pour Top: 0.64,23.5 29.21,23.5 29.21,46.35 15.24,46.35 15.24,38.1 0.64,38.1 0.64,71.75 30.48,71.75 30.48,61.59 52.7,61.59 52.7,71.75 77,71.75 76.91,28.78 60.11,28.78 59.93,28.68 59.94,28.05 60.03,20.41 71.03,20.45 71.03,28.18 73.08,28.18 76.72,28.23 76.83,20.41 76.83,0.64 0.64,0.64
  pour Bottom: 0.01,68.91 1.24,68.9 2.58,68.99 3.11,68.99 3.11,72.29 5.16,72.38 5.33,72.36 29.97,72.29 30.06,61.05 52.7,60.96 52.7,72.29 76.02,72.38 76.02,70.14 77.55,70.23 76.83,0 0.01,0 0.64,23.5 30.94,23.14 31.17,46.69 15.24,46.35 15.24,38.1 0.01,38.19 -0.09,45.43 0,67.67
GPIO_0  (via drill 0.25 pad 0.61)
  Top 0.254: IC13.33 IC13.34 21.47,20.15 v22.23,20.91 | R28.2 23.38,21.6 22.92,21.6 v22.23,20.91 | v22.23,14.4 22.23,15.65 IC13.25 20.97,15.65 | IC13.36 21.98,21.15 v22.23,20.91
  Bottom 0.254: v22.23,14.4 v22.23,20.91
GPIO_2
  Top 0.254: IC13.11 12.18,16.18 12.27,16.18 IC13.10 | IC13.11 IC13.10 | IC13.10 IC13.9 | IC13.11 IC13.12 9.51,15.65 R26.2
HP_L
  Top 0.61: R33.1 22.54,30.67 C33.1 22.54,33.47 22.14,33.87 21.6,34.4 19.94,34.4 C36.- 15.53,38.41 14.58,38.41 9.64,38.41 J5.P$2
HP_R  (1 unrouted)
  Top 0.813: R32.1 9.82,29.87 C34.1 9.73,29.99 J5.P$5
  Bottom 0.127: 21.43,41.75 C37.- | 12.86,34.29 12.71,34.29
  Bottom 0.406: J5.P$1 11.65,35.92 12.71,34.94 12.71,34.29 12.71,33.78 11.82,32.89 11.82,32.09 | 12.86,34.29 14.05,34.29 C37.-
ICHRG
  Top 0.406: R22.2 54.5,56.54 IC6.5
IR  (via drill 0.25 pad 0.61)
  Top 0.254: 31.65,56.27 IC5.4 | IC5.4 31.56,56.27 | v25.51,56.36 26.23,55.65 26.31,55.65 29.87,55.65 30.14,55.65 30.67,56.19 31.47,56.19 IC5.4
  Top 0.61: v25.51,68.54 27.15,68.54 IC10.P$1
  Bottom 0.254: v25.51,68.54 25.51,56.81 v25.51,56.36
LEFT
  Top 0.254: IC13.46 14.7,24.06 14.49,24.27 13.69,24.27 13.6,24.36 13.6,24.98 12.71,25.87 12.09,25.87 11.65,26.31 11.65,26.99 R31.2
  Top 0.61: R31.2 R32.2
MISO  (via drill 0.25 pad 0.61)  (1 unrouted)
  Top 0.254: IC13.30 23.47,18.14 23.56,18.22 41.87,18.22 42.14,18.58 v44.98,18.58 | v51.3,37.6 50.94,37.96 50.94,39.74 52.18,40.98 52.18,50.05 52.18,50.67 51.6,51.26 IC5.31 49.61,51.21 46.49,51.21 46.14,51.65 v45.52,51.65 | IC1.12 47.56,32.72 48.36,32.72 v49.07,33.43 | v27.29,50.32 21.51,50.32 20.89,50.94 v20.36,50.94 20.45,51.03 | J4.7 14.05,51.3 v15.38,51.3 | v45.07,9.42 48.36,9.42 48.9,8.89 X1.14
  Bottom 0.254: IC3.P$7 54.85,37.6 v51.3,37.6 49.7,37.6 49.07,36.98 v49.07,33.43 49.07,32.8 46.14,29.87 | 46.05,29.78 46.14,29.87 | v45.52,51.65 45.25,51.38 41.16,51.38 39.38,53.16 35.65,53.16 34.58,54.23 34.31,54.5 29.52,54.5 28.63,53.61 27.47,52.45 27.47,50.49 | v15.38,51.3 15.73,50.94 v20.36,50.94 | v45.07,9.42 45.07,18.49 v44.98,18.58 44.98,28.71 46.14,29.87
MOSI  (via drill 0.25, 0.25 pad 0.61)
  Top 0.127: v66.67,12.98 66.59,12.98 | 45.56,17.6 45.56,17.62 v45.7,17.6
  Top 0.203: 51.65,52.01 51.74,51.92 52.72,50.94 52.72,38.94 52.09,38.94 v52.01,38.85
  Top 0.24: 57.96,12.98 66.59,12.98 66.67,13.07 | 48.54,31.38 v51.12,34.05
  Top 0.254: v51.65,58.85 IC5.37 49.61,58.85 36.36,58.85 v36.36,55.56 | IC1.14 48.54,31.38 | 57.96,12.98 53.52,17.51 45.87,17.51 45.78,17.6 v45.7,17.6 45.56,17.6 23.65,17.6 23.6,17.65 IC13.29 | v51.74,53.87 51.65,53.78 51.65,52.01 | 52.01,38.94 v52.01,38.85 52.01,36.72 51.47,36.18 v51.12,36.18 | J4.3 14.98,46.98 15.38,46.58 23.65,46.58 v24,46.94
  Bottom 0.127: v66.67,12.98 66.67,13.07
  Bottom 0.254: IC3.P$6 52.54,38.32 v52.01,38.85 | v51.74,53.87 v51.65,58.85 | 67.21,27.74 LCD1.8 | v51.12,36.18 v51.12,34.05 51.12,33.34 47.65,29.87 46.14,28.36 45.7,27.91 v45.7,17.6 45.78,17.51 45.78,10.58 46.41,9.96 47.65,9.96 47.61,9.92 X1.13 | v36.36,55.56 34.14,55.56 33.52,54.94 29.25,54.94 26.23,51.92 26.23,47.03 24.09,47.03 v24,46.94
  Bottom 0.406: LCD1.8 67.21,27.74 69.43,27.74 69.96,27.29 70.05,19.65 66.67,16.54 66.67,13.07
N$1
  Top 0.61: Q2.3 50.94,25.25 | 50.94,25.25 50.94,25.34 | 50.94,25.34 50.76,25.43 50.76,25.51 Q3.1 | R9.2 50.94,25.25 | 50.94,25.25 50.94,25.34
N$2
  Top 0.24: R13.1 45.61,28.09 46.32,27.29 51.47,27.29 51.47,26.85 Q3.2
  Top 0.254: R13.1 45.52,28.18 R14.2
N$4
  Top 0.813: Q2.1 46.41,21.6 46.32,21.6 46.32,24.45 R5.2
N$5
  Bottom 0.406: R17.2 71.83,67.74 LED1.A
N$6  (via drill 0.25 pad 0.61)
  Top 0.406: v73.43,66.5 73.43,65.25 R19.1
  Bottom 0.406: LED3.A LED2.C 73.43,67.12 v73.43,66.5
N$9
  Top 0.254: 65.08,36.63 65.52,37.07 66.14,37.07 66.41,37.25 66.41,38.32
  Top 0.305: IC7.3 65.08,36.63 | 66.41,38.32 Q5.4
N$10  (via drill 0.25 pad 0.61)
  Top 0.406: IC7.1 67.03,36.54 67.3,37.43 67.3,39.2 66.67,39.83 v66.67,39.92 | v66.67,41.87 66.41,42.23 66.41,44.27 Q5.5
  Bottom 0.406: v66.67,41.87 v66.67,39.92
N$11
  Top 0.254: 31.65,26.58 IC11.4
  Top 0.406: 31.65,26.58 31.65,27.69 C17.1
N$12
  Top 0.254: IC7.5 66.05,34.85 70.5,34.85 71.12,35.56 72.99,35.56 R21.2
  Top 0.406: C6.2 65.43,32.36 66.05,32.98 IC7.5
N$13
  Top 0.254: IC7.2 66.05,35.47 66.14,35.29 68.36,35.29 R23.2
N$14
  Top 0.406: C16.1 35.61,21.24 IC12.4
N$15
  Top 0.254: Q5.3 Q5.2 65.43,38.58 65.43,38.67 | CN1.2 61.43,44.63 61.61,44.45
  Top 0.61: R23.1 68.1,37.96 68.1,39.83 67.3,40.63 67.12,40.89 65.43,40.89 | 65.43,40.89 63.56,40.89 63.48,40.89 | 65.43,38.67 65.43,40.8 65.43,40.89
  Top 0.813: 61.61,44.45 63.48,44.45 63.48,40.89 63.48,40.8
N$26
  Top 0.61: R31.1 8.49,27.11 C32.1
N$28
  Top 0.61: C31.1 22.76,29.29 R30.1
N$29
  Top 0.406: R34.1 19.02,28.68 C35.1
N$35
  Top 0.254: 46.05,33.07 R3.2 45.78,33.34 46.85,33.34 IC1.11
N$47  (via drill 0.25 pad 0.61)
  Top 0.254: R11.1 23.47,6.31 20,2.85 13.78,2.85 v12.62,2.85
  Bottom 0.254: 4.78,3.98 4.42,3.98 S1.B 5.11,4.71 5.78,4.71 6.58,3.91 6.93,3.91 8.98,5.96 9.51,5.96 v12.62,2.85
N$50  (via drill 0.25 pad 0.61)
  Top 0.254: R2.1 22.4,3.82 v21.69,3.11
  Bottom 0.254: v21.69,3.11 21.69,0.71 10.76,0.71 10.67,0.71 8.89,2.49 8.45,2.93 7.29,2.93 S1.D
RAM_CLK  (via drill 0.25 pad 0.61)
  Top 0.254: v39.03,47.12 47.3,47.12 47.74,47.47 IC5.28 | v36.45,35.38 IC9.6
  Bottom 0.254: v36.45,35.38 36.45,38.41 37.34,39.38 37.34,44.18 39.03,45.87 v39.03,47.12
RAM_CS  (via drill 0.25 pad 0.61)
  Top 0.254: v41.69,32.8 IC9.1 43.49,31.89 43.92,31.47 43.92,30.1 R24.2 44.01,30.05 | IC5.27 49.61,46.23 48.72,46.23 48.18,45.7 v43.38,45.7
  Bottom 0.254: v41.69,32.8 42.14,32.8 43.2,33.87 43.2,45.34 v43.38,45.7
RCAP
  Top 0.254: IC13.44 15.7,25.38 15.16,25.38 14.76,25.78 C30.2
RESET  (via drill 0.25 pad 0.61)
  Top 0.24: 63.39,32.27 61.61,30.49 v61.61,29.16
  Top 0.254: v33.16,57.61 32.54,57.61 IC5.3 | J3.5 64.81,8.18 v61.43,8.18 | v61.61,41.96 v61.61,40.01 | 63.39,32.27 64.19,33.07 64.19,36.8 v63.39,37.6
  Top 0.406: C4.2 R10.2 55.65,9.07 55.92,8.89 56.98,8.89 S2.2 61.25,8.36 v61.43,8.18
  Bottom 0.254: v33.16,57.61 46.58,57.61 48.27,55.92 48.27,53.96 52.98,49.25 58.05,49.25 61.52,45.78 v61.61,41.96 | v61.61,40.01 61.61,39.38 v63.39,37.6 | 61.43,8.27 v61.43,8.18
  Bottom 0.406: v61.61,29.16 61.61,8.36 61.43,8.27
RIGHT  (via drill 0.25 pad 0.61)
  Top 0.254: v17.87,25.6 17.87,24.36 18.2,24.03 IC13.39
  Top 0.61: R30.2 R33.2 v19.47,30.58
  Bottom 0.61: v17.87,25.6 17.87,30.32 18.14,30.58 v19.47,30.58
RX  (via drill 0.25, 0.25 pad 0.61)
  Top 0.24: 55.56,35.29 58.94,35.29 v61.96,32.27
  Top 0.254: IC5.34 49.7,55.12 52.18,55.12 52.72,54.59 52.72,52.09 53.16,51.56 53.16,36.18 53.34,36.01 54.85,36.01 55.56,35.29 | v62.59,10.4 69.88,10.4 J3.1
  Bottom 0.406: v61.96,32.27 62.59,31.74 v62.59,10.4
RX_MP3
  Top 0.254: R29.1 23.29,16 23.11,16.18 | 23.02,16.18 R29.1 | IC13.26 22.91,16.15 R29.1
SCK  (via drill 0.25 pad 0.61)
  Top 0.254: IC13.28 21.6,17.16 21.78,16.98 43.29,16.98 43.65,16.71 v44.27,16.71 | IC1.16 47.56,30.05 45.16,30.05 v45.07,29.96 | v46.76,50.41 47.21,49.96 IC5.30 50.85,49.96 51.38,49.43 51.38,41.78 v51.38,41.25 | v12.36,49.16 13.96,49.16 J4.5 | v20.45,49.87 20.89,49.52 v28,49.52 | v71.65,8.27 71.65,1.25 52.09,1.25 52.09,5.07 50.14,5.07 50.14,2.58 45.07,2.58 X1.11 45.07,7.64 44.45,7.64 43.83,8.27 43.83,10.05 v44.27,10.49
  Bottom 0.254: IC3.P$3 51.47,40.72 51.38,40.72 | 51.38,40.72 51.03,40.72 47.03,36.72 47.03,31.91 v45.07,29.96 44.27,29.16 v44.27,16.71 v44.27,10.49 | v20.45,49.87 12.98,49.87 v12.36,49.16 | 67.21,28.54 LCD1.9 | v51.38,41.25 51.38,40.72 | v46.76,50.41 45.52,50.41 45.34,50.41 44.81,50.94 40.54,50.94 40.36,50.94 39.38,51.92 38.76,52.54 35.38,52.54 34.49,53.43 33.96,53.96 29.78,53.96 28.8,52.98 28,52.18 v28,49.52
  Bottom 0.406: 67.21,28.54 71.74,28.54 72.19,28.09 72.19,8.8 v71.65,8.27
SD0  (via drill 0.25 pad 0.61)
  Top 0.254: IC5.45 49.61,38.58 42.58,38.58 | IC9.2 v41.69,34.05 | 42.58,38.58 v42.49,38.58 | IC5.21 42.53,38.63 42.58,38.58
  Bottom 0.254: v42.49,38.58 42.49,34.4 v41.69,34.05
SD1  (via drill 0.25 pad 0.61)
  Top 0.254: v38.58,43.83 43.38,43.83 43.83,43.47 43.83,42.14 IC5.22 43.83,42.13 43.83,39.56 44.18,39.2 44.63,39.2 48.01,39.2 48.63,39.83 49.61,39.83 IC5.46 | IC9.5 38.32,36.63 38.32,37.16 37.78,37.6 v37.6,37.6
  Bottom 0.254: v38.58,43.83 38.14,43.38 38.14,39.03 37.6,38.58 v37.6,37.6
SD2  (via drill 0.25 pad 0.61)
  Top 0.254: IC5.41 v35.74,39.83 36.45,39.83 37.43,40.8 37.45,40.83 IC5.17 | IC9.7 v35.74,34.14
  Bottom 0.254: 36.01,39.83 36.09,39.83 36.01,39.83 | 36.01,39.83 v35.74,39.83 35.74,38.76 v35.74,34.14
SD3
  Top 0.254: IC5.42 38.76,38.58 | IC9.3 42.14,35.38 41.87,35.56 41.43,36.01 41.43,37.6 40.54,38.58 38.76,38.58 | IC5.18 38.72,38.62 38.76,38.58
STAB-5V
  Top 0.254: 62.41,54.23 R7.1
  Top 0.406: 64.01,54.23 IC4.5 64.01,54.23 | 62.41,54.23 64.01,54.23
  Top 0.61: 64.01,54.23 63.78,54 R15.1 63.78,51.08 64.01,50.85 65.25,50.85 65.34,50.76 66.14,49.96 66.14,48.67 66.14,46.67 66.9,46.67 D3.- 67.96,45.61 68.1,45.61 69.88,45.61 69.88,46.59 Q1.2
  Top 0.813: 69.88,45.61 74.32,45.61 C3.+
  Top 1.016: 74.32,45.61 74.32,45.7 TP1.TP
STAB_5V_OUT
  Top 0.813: IC2.VOUT+ 69.52,60.53 69.52,52.9 70.01,52.4 R1.1 69.85,51.13 Q1.1 69.78,48.58 D3.+
TFT_BL  (via drill 0.25 pad 0.61)
  Top 0.24: R13.2 48.09,28.18 v48.36,28.45
  Top 0.254: v65.7,20.09 59.92,20.09 59.92,22.85 v48.18,22.85
  Bottom 0.24: v48.36,28.45 48.36,29.34 52.09,32.98
  Bottom 0.254: LCD1.4 65.7,24.45 v65.7,20.09 | IC3.P$10 52.09,35.2 52.09,32.98 | v48.36,28.45 48.36,23.2 v48.18,22.85
TFT_CS  (via drill 0.25 pad 0.61)
  Top 0.254: IC5.40 33.16,41.07 33.69,40.63 35.47,40.63 36.18,41.34 IC5.16 v36.18,43.83 | v36.18,48.27 36.72,47.92 v46.94,47.92 | X1.10 43.92,6.31 43.92,3.02 44.9,2.04 50.76,2.04 50.76,3.91 v51.12,4.36
  Bottom 0.254: v36.18,43.83 v36.18,48.27 | 67.21,31.03 LCD1.12 67.2,30.85 66.32,30.85 66.23,30.76 65.61,30.76 65.34,31.03 65.34,33.96 64.54,34.76 62.67,36.63 | 62.67,36.63 60.19,39.2 59.03,39.2 | v46.94,47.92 54.23,47.92 59.12,43.03 59.12,39.29 59.03,39.2 | 62.67,36.63 59.65,33.69 59.65,29.25 58.5,28 53.07,28 51.21,26.23 51.21,4.36 v51.12,4.36 | 59.03,39.2 54.85,39.2 IC3.P$5
TFT_RST  (via drill 0.25 pad 0.61)
  Top 0.254: v57.61,41.6 57.78,41.6 57.78,37.87 57.87,37.78 59.21,37.78 61.61,35.38 62.14,35.38 v62.23,35.29 | v33.96,51.12 31.77,51.12 IC5.8
  Bottom 0.24: 54.14,18.76 54.14,22.4 54.76,23.02 58.41,23.02 60.36,24.89
  Bottom 0.254: v33.96,51.12 39.65,51.12 40.54,50.14 43.92,50.14 44.09,50.41 44.81,50.41 45.43,49.78 45.43,48.27 45.43,47.92 45.16,47.65 45.16,43.2 45.16,40.8 46.05,40.8 46.41,41.16 46.41,42.41 46.58,42.58 46.85,42.85 47.56,42.85 48.18,42.85 49.07,41.96 51.74,41.96 51.83,41.87 52.18,41.52 52.36,41.52 54.76,41.52 IC3.P$2 54.85,41.6 v57.61,41.6 | LCD1.6 67.12,26.23 64.81,26.23 64.81,32.89 v62.23,35.29 62.23,35.2 60.36,33.34 60.36,24.89 | X1.9 44.09,2.22 53.96,2.22 54.14,2.4 54.14,11.11 54.14,18.76
TX  (via drill 0.25 pad 0.61)
  Top 0.24: 59.65,35.74 v62.14,33.25
  Top 0.254: IC5.35 49.61,56.36 52.01,56.36 53.25,55.12 53.25,52.36 53.7,51.92 53.7,37.52 53.7,36.89 53.87,36.72 54.76,36.72 55.74,35.74 55.83,35.74 59.65,35.74
  Bottom 0.254: v62.14,33.25 63.56,31.83 63.56,10.85 66.14,8.27 66.14,5.16 J3.4
U3V3
  Bottom 0.61: J3.2 72.99,3.82 73.08,3.82 73.25,4 D5.+
V_BATT  (via drill 0.25 pad 0.61)
  Top 0.61: 58.23,51.92 59.65,51.92 59.65,47.03 CN1.1 59.38,40.27 59.38,39.47 59.92,38.94 60.45,38.94 v63.48,38.94 | 58.23,51.92 C9.2 58.23,51.92 | IC6.3 58.23,51.92
  Top 0.813: v70.23,38.85 74.14,38.85 R21.1 75.3,36.63 76.01,36.63 76.1,36.54 76.1,31.29 Q4.3
  Bottom 0.61: v63.48,38.94 v70.23,38.85
VBUS
  Top 0.406: 72.54,56.45 J2.VBUS 70.94,56.45 70.94,50.94 70.94,49.92 D2.- 70.9,48.62 Q1.3
VIN+
  Bottom 1.016: D1.+ 13.87,65.43 J1.PWR
X+  (via drill 0.3)
  Top 0.127: 53.34,30.76 IC1.2
  Top 0.254: 53.34,30.76 v52.27,30.76
  Bottom 0.127: 52.9,31.11 54.76,31.11 IC3.P$15
  Bottom 0.254: 52.9,31.11 52.63,31.11 v52.27,30.76
X-  (via drill 0.3)
  Top 0.24: v57.43,29.25 54.85,31.83 54.67,32.09 53.43,32.09 IC1.4
  Bottom 0.127: 56.72,29.52 54.94,29.52 IC3.P$17
  Bottom 0.24: 56.72,29.52 57.16,29.52 v57.43,29.25
XCS  (via drill 0.25 pad 0.61)
  Top 0.254: IC5.23 45.07,40.72 45.43,40.45 v46.85,40.45 48.27,40.45 48.9,41.07 49.61,41.07 IC5.47 | D6.2 9.78,10.13 v10.94,10.13 | 32.36,10.13 v21.96,10.13 20.09,12 18.76,12 18.7,12.06 IC13.23 | v42.58,12.8 arc90 42.58,12.71 v42.58,12.8 | 32.36,10.13 X1.1 | 32.36,10.13 32.72,10.13 32.89,10.31 32.89,11.91 33.07,12.09 41.87,12.09 v42.58,12.8
  Bottom 0.254: v10.94,10.13 v21.96,10.13 | v46.85,40.45 46.85,38.67 45.43,37.25 45.43,32.72 42.58,29.87 v42.58,12.8
XDCS  (via drill 0.25 pad 0.61)
  Top 0.254: IC5.48 49.61,42.14 v47.65,42.14 IC5.24 | v43.2,11.47 v33.69,11.47 33.43,11.2 33.43,10.05 32.98,9.6 32.89,9.51 32.89,7.73 32.89,7.09 X1.2 | v31.74,11.47 25.51,11.47 v25.25,11.65 | 13.69,14.13 IC13.13 13.54,14.31 10.49,14.31 10.31,14.13 10.22,14.05 v10.22,11.65 8.45,11.65 7.91,11.11 7.91,10.41 D6.1
  Bottom 0.254: v47.65,42.14 47.65,38.14 46.32,36.8 46.32,32.36 43.38,29.43 43.38,11.65 v43.2,11.47 | v33.69,11.47 v31.74,11.47 | v10.22,11.65 11.29,11.65 11.47,11.82 12.54,11.82 12.71,11.65 25.16,11.65 v25.25,11.65
XRESET
  Top 0.254: 4.09,9.69 R27.2 4.04,9.6 SJ1.2 4.09,11.96 4.09,13.42 4.89,13.42 | D6.3 8,13.42 4.89,13.42 | D6.3 8.98,12.62 | 8.98,12.71 D6.3 | 4.89,13.42 4.89,22.05 10.31,22.05 10.76,21.6 10.76,20.98 10.76,20.45 11.02,20.18 12.17,20.18 IC13.3
XRST  (via drill 0.25 pad 0.61)
  Top 0.09: 31.56,43.47 IC5.14
  Top 0.24: 5.6,10.49 5.6,11.91 SJ1.1
  Top 0.254: 5.6,10.49 4.89,10.49 4.8,10.4 4.8,6.49 4.8,5.96 5.69,5.07 5.69,4 8.27,1.42 33.96,1.42 35.03,2.49 35.03,3.68 X1.3 | IC5.14 31.03,43.65 30.05,43.65 30.05,36.27 30.4,35.92 v33.69,35.92
  Bottom 0.24: v33.69,35.92 33.69,28.54 35.56,26.67 35.56,7.82
  Bottom 0.254: 35.56,7.82 35.56,7.29 34.94,6.67 34.94,3.82 X1.3
XTAL+
  Top 0.254: IC13.17 15.7,12.59 15.47,12.36 15.47,12.23 R25.1 15.15,10.63 Y1.1 15.19,7.47 15.29,7.47 15.82,7.47 15.87,7.42 C25.2
XTAL-
  Top 0.254: IC13.18 16.2,12.57 R25.2 16.85,10.63 Y1.2 18.85,8.62 17.6,7.38 17.16,7.38 17.16,5.37 C24.2
Y+  (via drill 0.3)
  Top 0.127: 53.34,31.47 IC1.3
  Top 0.254: 53.34,31.47 52.54,31.47 v52.27,31.74
  Bottom 0.254: IC3.P$16 52.76,30.36 52.54,30.14 51.74,30.14 51.65,30.23 51.65,31.29 51.65,31.65 52.18,31.65 v52.27,31.74
Y-  (via drill 0.3)
  Top 0.127: 53.16,32.54 53.34,32.72 IC1.5
  Top 0.254: 53.16,32.54 51.83,32.54 51.56,32.27 51.56,32.18 51.56,29.69 v51.74,29.52
  Bottom 0.24: v51.74,29.52 51.92,29.52 52.63,28.8 54.76,28.8 IC3.P$18

## Text on the board
Top: DC DC 5V / / IN-->OUT | Radiva 5 | L G R | 3V3 | Designed by / RSH 2019 | RST D0 RX / GND TX V+
Bottom: + | + | VOL+ / / P- S P+ / / VOL-
tNames: -V | STAB 5V | +3V3
bNames: 5V
tValues: XDCS/DREQ/TCS/A|D/DCS/SCS/MI / XCS/XRST/GND/+5V/DRS/SCK/MO